# EAGLE design M307mod (EAGLE 4.11)
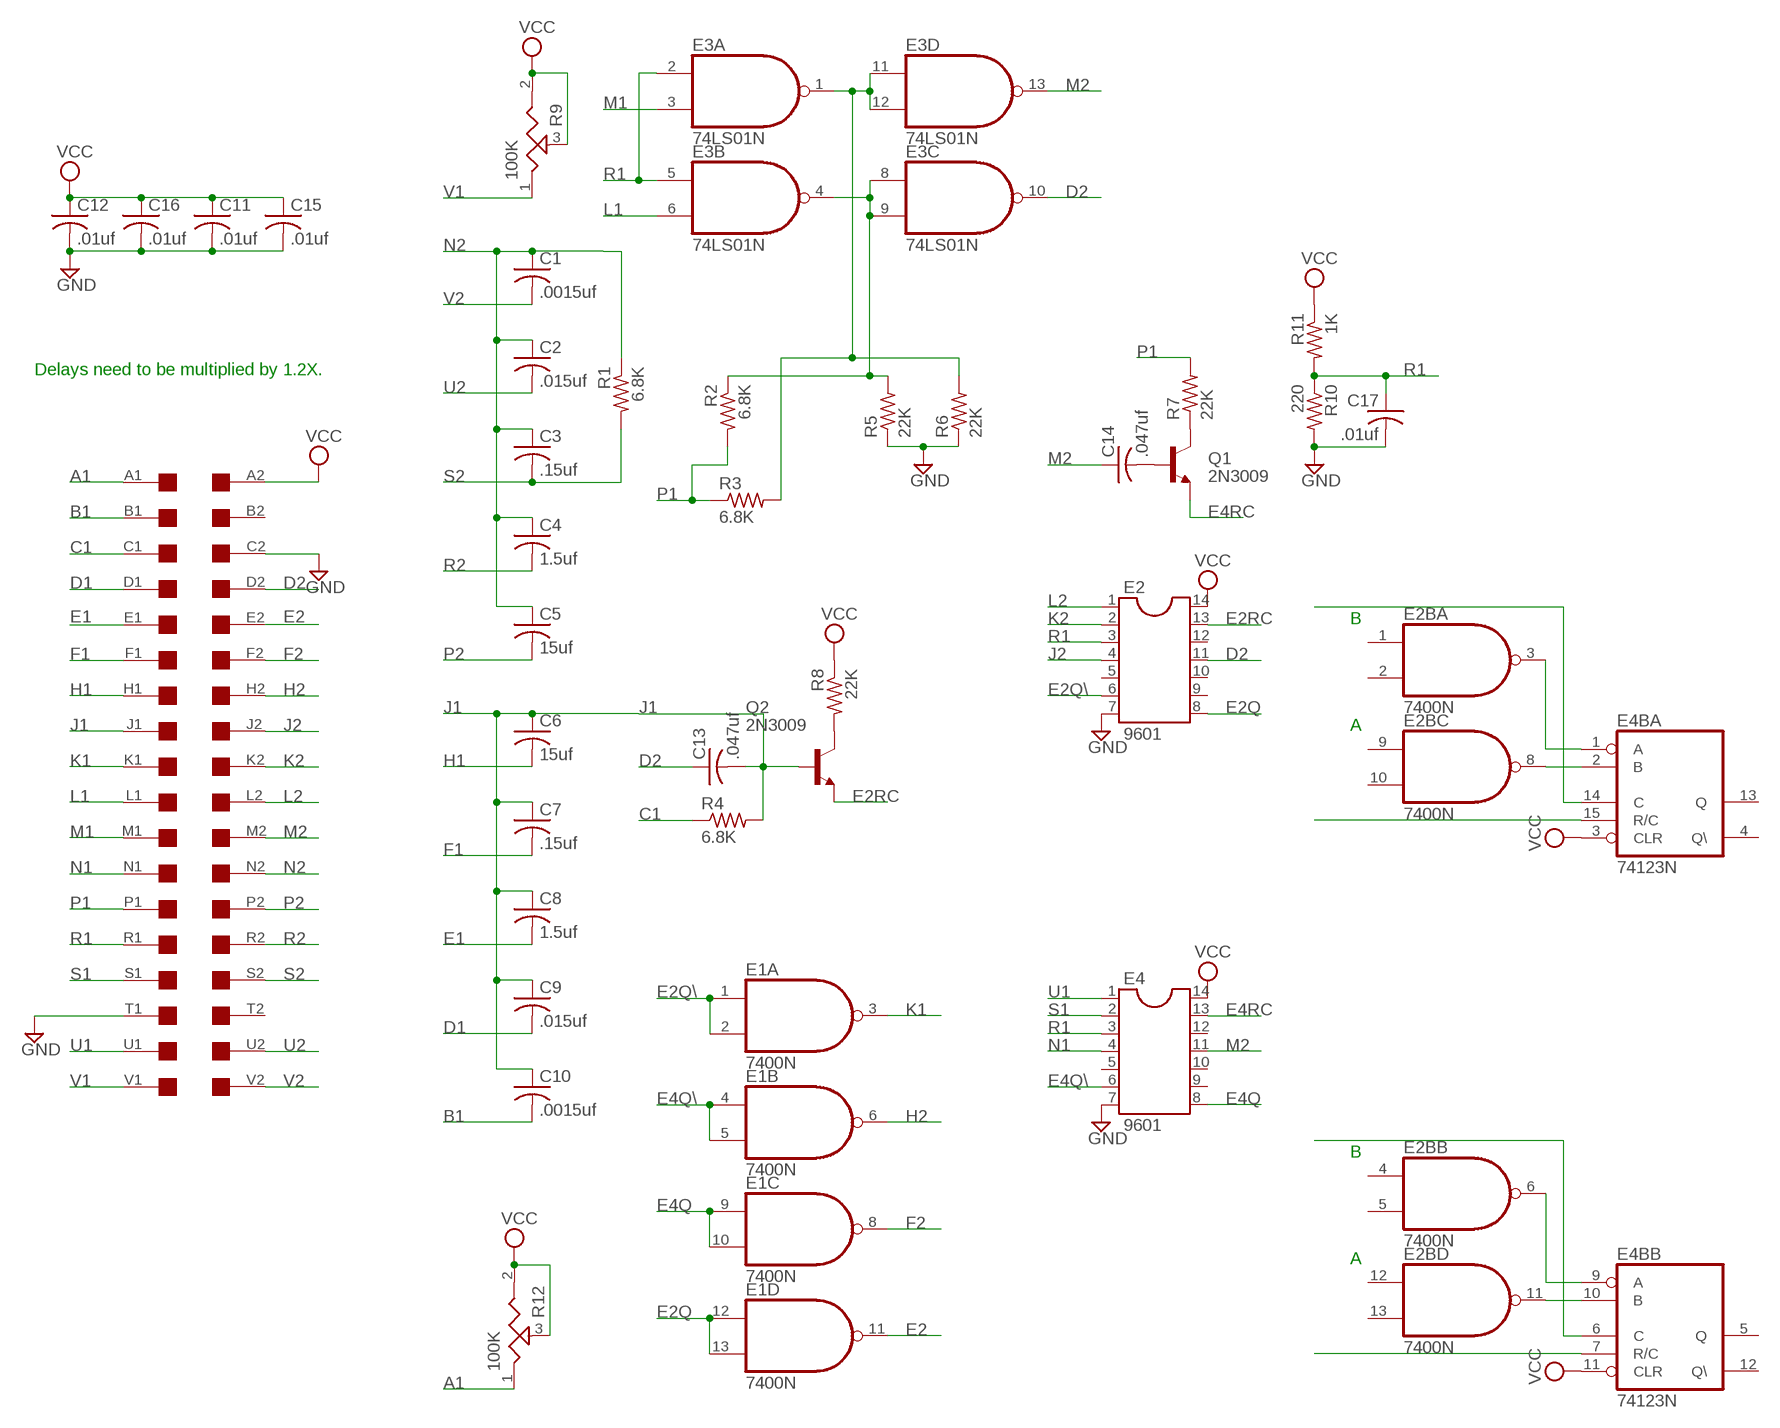
[diagram p0: schematic, sheet 1]

## Parts
A  DEC-FLIPCHIP  [DEC-FLIPCHIP]
C1  .0015uf  C-US150-054X183  [C150-054X183]
C2  .015uf  C-US050-025X075  [C050-025X075]
C3  .15uf  C-US102-043X133  [C102-043X133]
C4  1.5uf  C-US150-054X183  [C150-054X183]
C5  15uf  C-US150-054X183  [C150-054X183]
C6  15uf  C-US150-054X183  [C150-054X183]
C7  .15uf  C-US102-043X133  [C102-043X133]
C8  1.5uf  C-US150-054X183  [C150-054X183]
C9  .015uf  C-US050-025X075  [C050-025X075]
C10  .0015uf  C-US150-054X183  [C150-054X183]
C11  .01uf  C-US050-025X075  [C050-025X075]
C12  .01uf  C-US050-025X075  [C050-025X075]
C13  .047uf  C-US075-032X103  [C075-032X103]
C14  .047uf  C-US075-032X103  [C075-032X103]
C15  .01uf  C-US050-025X075  [C050-025X075]
C16  .01uf  C-US050-025X075  [C050-025X075]
C17  .01uf  C-US050-025X075  [C050-025X075]
E1  7400N  [DIL14]
E2  9601  DIL14  [DIL14]
E2B  7400N  [DIL14]
E3  74LS01N  [DIL14]
E4  9601  DIL14  [DIL14]
E4B  74123N  [DIL16]
Q1  2N3009  2N3019-NPN-TO39-EBC  [TO39]
Q2  2N3009  2N3019-NPN-TO39-EBC  [TO39]
R1  6.8K  R-US_0207/10  [0207/10]
R2  6.8K  R-US_0207/10  [0207/10]
R3  6.8K  R-US_0207/10  [0207/10]
R4  6.8K  R-US_0207/10  [0207/10]
R5  22K  R-US_0207/10  [0207/10]
R6  22K  R-US_0207/10  [0207/10]
R7  22K  R-US_0207/10  [0207/10]
R8  22K  R-US_0207/10  [0207/10]
R9  100K  POTUS-TRIM  [PT-SPIN]
R10  220  R-US_0207/10  [0207/10]
R11  1K  R-US_0207/10  [0207/10]
R12  100K  POTUS-TRIM  [PT-SPIN]

## Nets
A1: A.A1 R12.1
B1: A.B1 C10.2
C1: A.C1 R4.1
CX1: E4B.14(A:C)
CX2: E4B.6(B:C)
D1: A.D1 C9.2
D2: A.D2 C13.1 E2.11 E3.10(C:O)
E1: A.E1 C8.2
E2: A.E2 E1.11(D:O)
E2Q: E1.12(D:I0) E1.13(D:I1) E2.8
E2Q\: E1.1(A:I0) E1.2(A:I1) E2.6
E2RC: E2.13 Q2.1(E)
E4Q: E1.9(C:I0) E1.10(C:I1) E4.8
E4Q\: E1.4(B:I0) E1.5(B:I1) E4.6
E4RC: E4.13 Q1.1(E)
F1: A.F1 C7.2
F2: A.F2 E1.8(C:O)
GND [power]: A.C2 A.T1 C11.2 C12.2 C15.2 C16.2 C17.2 E2.7 E4.7 R5.1 R6.1 R10.2
H1: A.H1 C6.2
H2: A.H2 E1.6(B:O)
J1: A.J1 C6.1 C7.1 C8.1 C9.1 C10.1 C13.2 Q2.2(B) R4.2
J2: A.J2 E2.4
K1: A.K1 E1.3(A:O)
K2: A.K2 E2.2
L1: A.L1 E3.6(B:I1)
L2: A.L2 E2.1
M1: A.M1 E3.3(A:I1)
M2: A.M2 C14.1 E3.13(D:O) E4.11
N1: A.N1 E4.4
N2: A.N2 C1.1 C2.1 C3.1 C4.1 C5.1 R1.1
N$1: Q1.3(C) R7.1
N$2: E4B.15(A:R/C)
N$3: Q2.3(C) R8.2
N$4: E3.1(A:O) E3.11(D:I0) E3.12(D:I1) R3.2 R6.2
N$5: E3.4(B:O) E3.8(C:I0) E3.9(C:I1) R2.1 R5.2
N$6: C14.2 Q1.2(B)
N$11: E2B.3(A:O) E4B.1(A:A)
N$12: E2B.8(C:O) E4B.2(A:B)
N$13: E2B.6(B:O) E4B.9(B:A)
N$14: E2B.11(D:O) E4B.10(B:B)
N$15: E4B.7(B:R/C)
P1: A.P1 R2.2 R3.1 R7.2
P2: A.P2 C5.2
R1: A.R1 C17.1 E2.3 E3.2(A:I0) E3.5(B:I0) E4.3 R10.1 R11.2
R2: A.R2 C4.2
S1: A.S1 E4.2
S2: A.S2 C3.2 R1.2
U1: A.U1 E4.1
U2: A.U2 C2.2
V1: A.V1 R9.1
V2: A.V2 C1.2
VCC [power]: A.A2 C11.1 C12.1 C15.1 C16.1 E2.14 E4.14 E4B.3(A:CLR) E4B.11(B:CLR) R8.1 R9.2 R9.3 R11.1 R12.2 R12.3
Unconnected: A.B2 A.T2 E2.5 E2.9 E2.10 E2.12 E2B.1(A:I0) E2B.2(A:I1) E2B.4(B:I0) E2B.5(B:I1) E2B.9(C:I0) E2B.10(C:I1) E2B.12(D:I0) E2B.13(D:I1) E4.5 E4.9 E4.10 E4.12 E4B.4(A:Q\) E4B.5(B:Q) E4B.12(B:Q\) E4B.13(A:Q)

## Notes on the sheet
- Delays need to be multiplied by 1.2X.
- B
- A
- B
- A

## Power pins joined to a net without a drawn wire
GND: E1.7(P:GND) E2B.7(P:GND) E3.7(P:GND) E4B.8(P:GND)
VCC: E1.14(P:VCC) E2B.14(P:VCC) E3.14(P:VCC) E4B.16(P:VCC)

## Library data of the parts
A = con-dec:DEC-FLIPCHIP: Two-sided DEC Flip-Chip single card fingers
C1-C17 = rcl:C-US: CAPACITOR, American symbol
E1 E2B = 74xx-us:74*00: Quad 2-input NAND gate
E2 E4 = ic-package:DIL14: Dual In Line
E3 = 74xx-us:74*01: Quad 2-input NAND gate, open collector
E4B = 74xx-us:74*123: Retriggerable monostable MULTIVIBRATOR
Q1 Q2 = transistor:*-NPN-: NPN Transistror
R1-R8 R10 R11 = rcl:R-US_: RESISTOR, American symbol
R9 R12 = discrete:POTUS-TRIM

## Net classes
1 power: width 0.508 mm, drill 0.508 mm

## Board
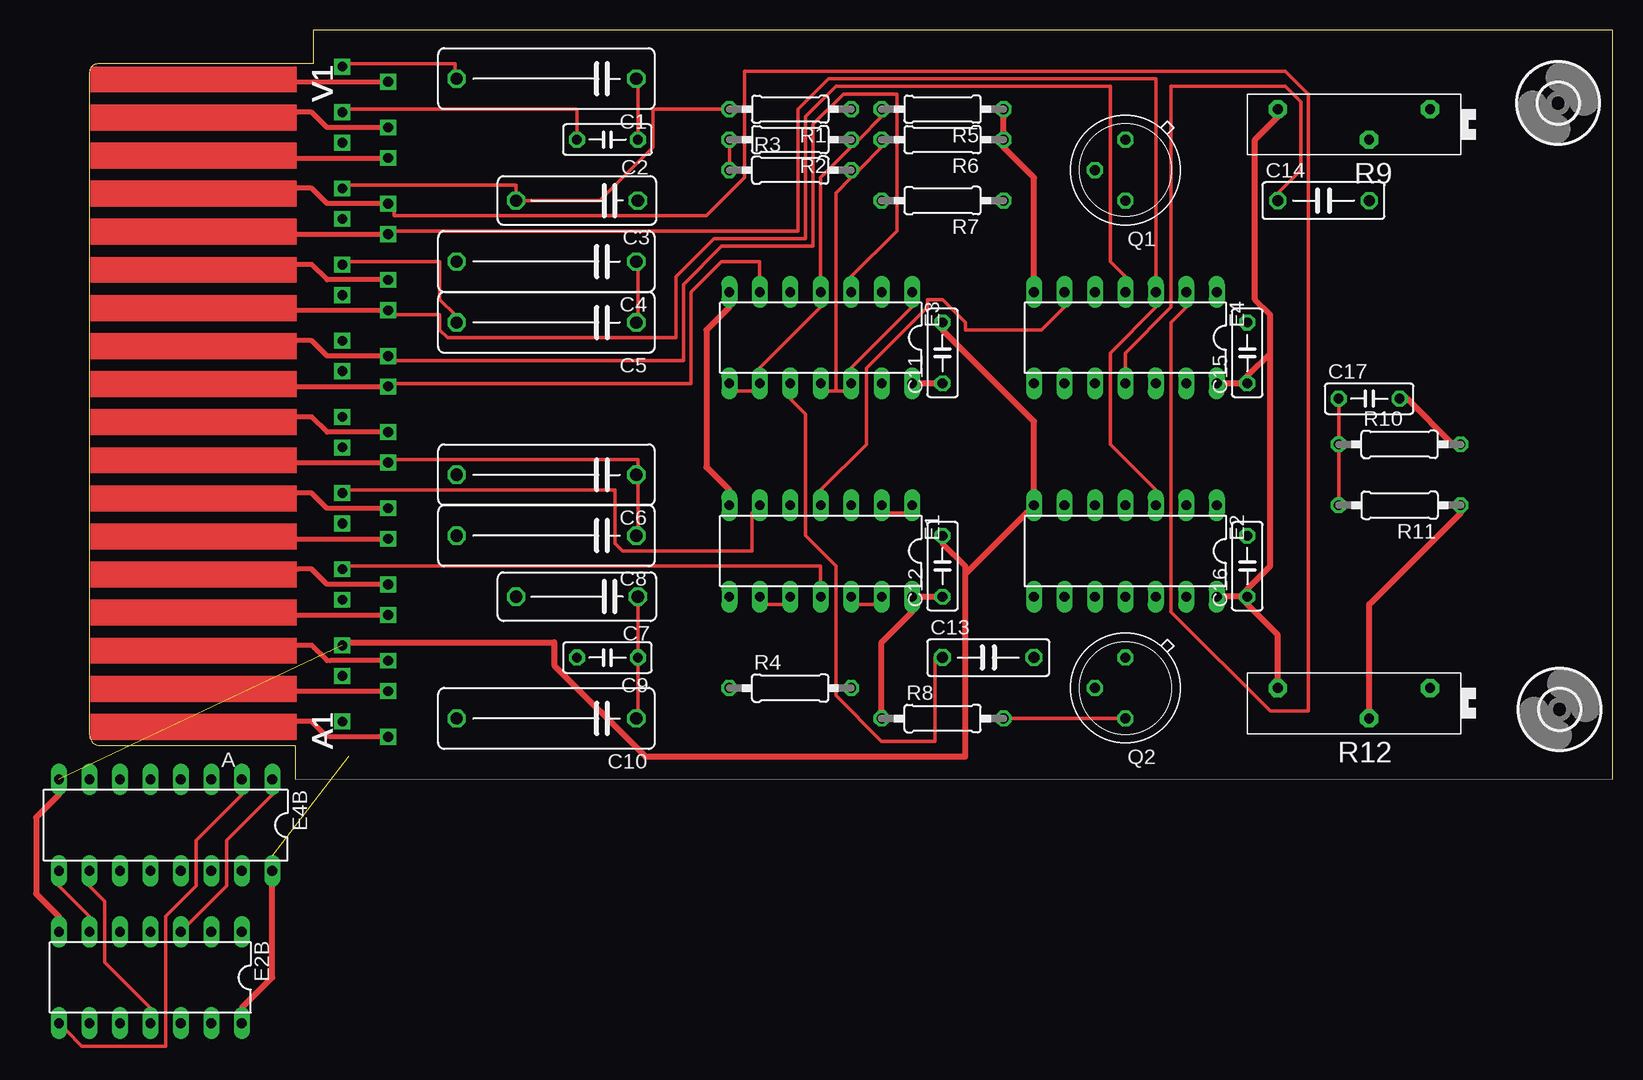
[diagram p1: board, top side]
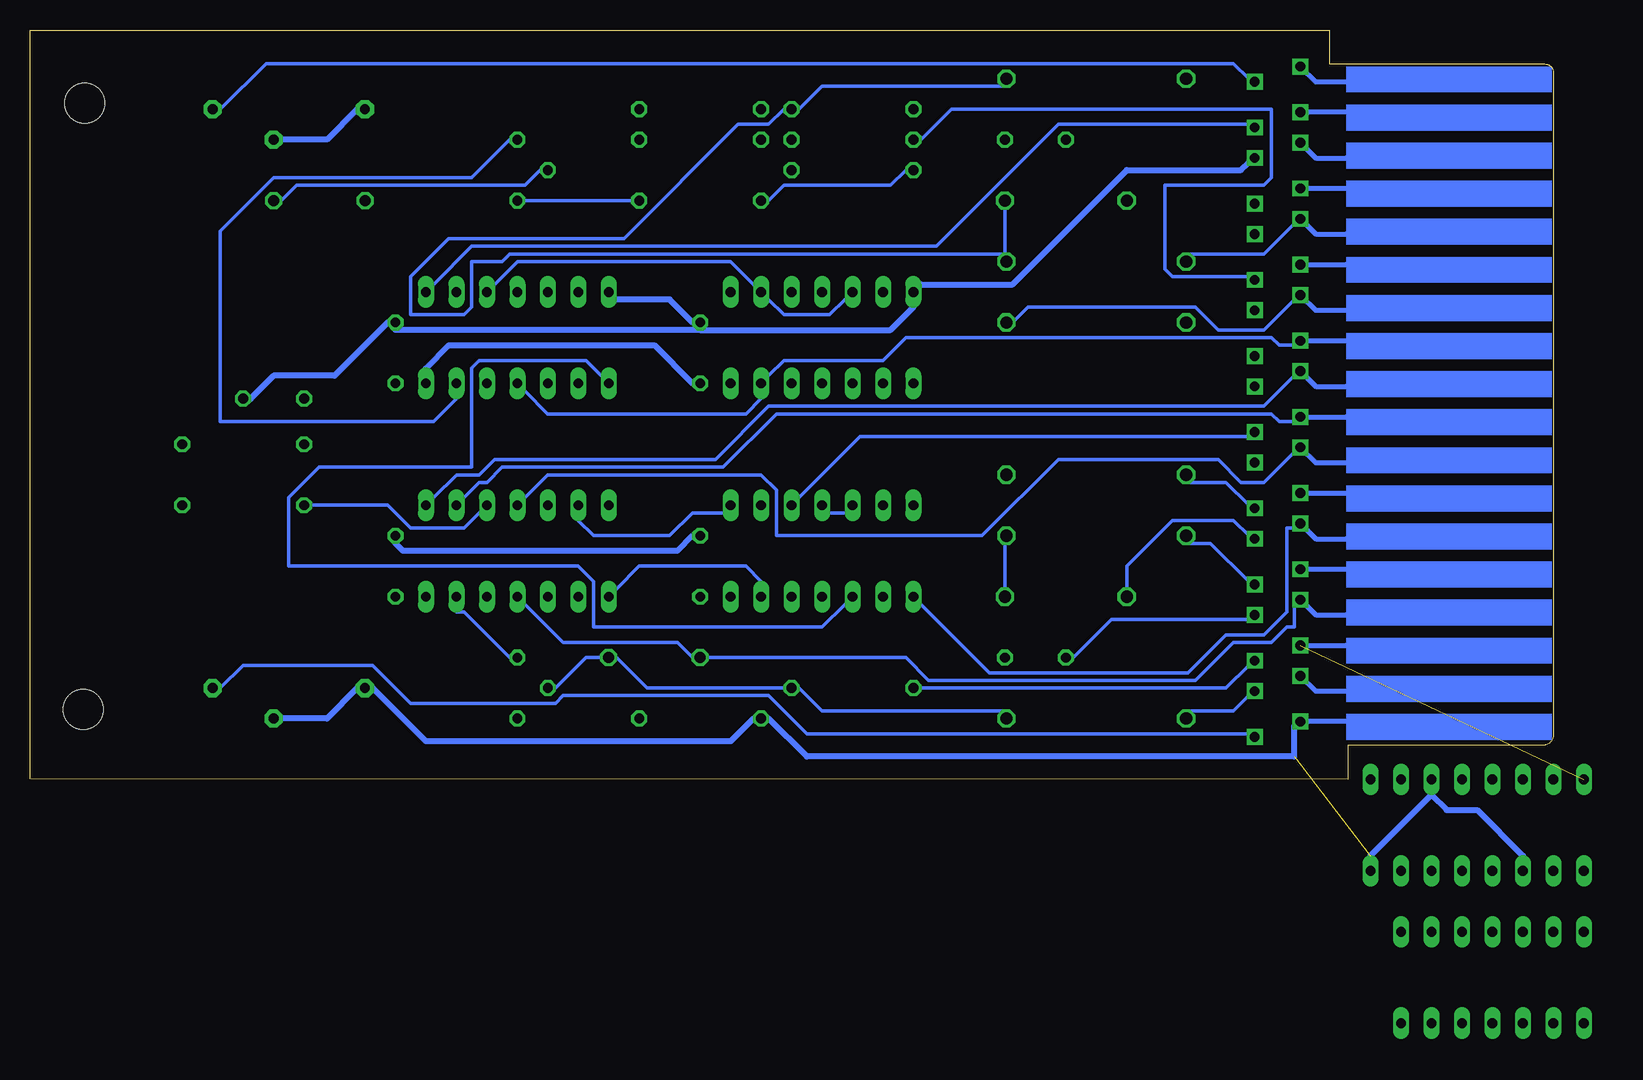
[diagram p2: board, bottom side, seen from below]

Size 126.98 x 62.48 mm. Coordinates in mm from the lower left corner, seen from the top.
Outline: 17.14,2.83 17.14,0 126.98,0.04 126.98,62.45 18.66,62.48 18.66,59.65 0.69,59.65 arc90 0,58.96 0,3.72 arc90 0.89,2.83 17.14,2.83
Copper layers (1*16): Top 0.035mm / dielectric 1.5mm / Bottom 0.035mm
Design rules "10mils": minimum track width 12mil, minimum drill 28mil, track to track 10mil, track to pad 10mil, pad to pad 10mil, via to via 10mil, smd to smd 10mil, copper to edge 40mil, drill to drill 10mil, minimum pad ring 10mil, minimum via ring 8mil, stop-mask expansion 0mil, vias tented up to drill 0mil, thermal gap 10mil

### Footprints (pad centres in the part's own frame; a part is rotated, then mirrored left to right if it is on the bottom)
DEC-FLIPCHIP = drill 0.813 square: A1 -7.62,27.94; A2 -3.81,26.67; B1 -7.62,24.13; B2 -3.81,22.86; C1 -7.62,21.59; C2 -3.81,20.32; D1 -7.62,17.78; D2 -3.81,16.51; E1 -7.62,15.24; E2 -3.81,13.97; F1 -7.62,11.43; F2 -3.81,10.16; H1 -7.62,8.89; H2 -3.81,7.62; J1 -7.62,5.08; J2 -3.81,3.81; K1 -7.62,2.54; K2 -3.81,1.27; L1 -7.62,-1.27; L2 -3.81,-2.54; M1 -7.62,-3.81; M2 -3.81,-5.08; N1 -7.62,-7.62; N2 -3.81,-8.89; P1 -7.62,-10.16; P2 -3.81,-11.43; R1 -7.62,-13.97; R2 -3.81,-15.24; S1 -7.62,-16.51; S2 -3.81,-17.78; T1 -7.62,-20.32; T2 -3.81,-21.59; U1 -7.62,-22.86; U2 -3.81,-24.13; V1 -7.62,-26.67; V2 -3.81,-27.94
C150-054X183 = drill 1.016 octagon: 1 -7.493,0; 2 7.493,0
C050-025X075 = drill 0.813 octagon: 1 -2.54,0; 2 2.54,0
C102-043X133 = drill 1.016 octagon: 1 -5.08,0; 2 5.08,0
C075-032X103 = drill 0.914 octagon: 1 -3.81,0; 2 3.81,0
DIL14 = drill 0.813 long: 1 -7.62,-3.81; 2 -5.08,-3.81; 3 -2.54,-3.81; 4 0,-3.81; 5 2.54,-3.81; 6 5.08,-3.81; 7 7.62,-3.81; 8 7.62,3.81; 9 5.08,3.81; 10 2.54,3.81; 11 0,3.81; 12 -2.54,3.81; 13 -5.08,3.81; 14 -7.62,3.81
DIL16 = drill 0.813 long: 1 -8.89,-3.81; 2 -6.35,-3.81; 3 -3.81,-3.81; 4 -1.27,-3.81; 5 1.27,-3.81; 6 3.81,-3.81; 7 6.35,-3.81; 8 8.89,-3.81; 9 8.89,3.81; 10 6.35,3.81; 11 3.81,3.81; 12 1.27,3.81; 13 -1.27,3.81; 14 -3.81,3.81; 15 -6.35,3.81; 16 -8.89,3.81
TO39 = drill 0.813 octagon: 1 0,-2.54; 2 2.54,0; 3 0,2.54
0207/10 = drill 0.813 octagon: 1 -5.08,0; 2 5.08,0
PT-SPIN = drill 0.813 pad 1.524 octagon: 1 -6.35,-1.27; 2 6.35,-1.27; 3 -1.27,1.27
3,3 = hole 3.3: 0,0

### Placement (x,y rotation side)
A  17.27,31.5 180 top
C1  38.09,58.42 180 top
C2  43.17,53.34 180 top
C3  40.63,48.26 180 top
C4  38.09,43.18 180 top
C5  38.09,38.1 180 top
C6  38.09,25.4 180 top
C7  40.63,15.24 180 top
C8  38.09,20.32 180 top
C9  43.17,10.16 180 top
C10  38.09,5.08 180 top
C11  71.12,35.56 90 top
C12  71.12,17.78 90 top
C13  74.93,10.16 0 top
C14  102.87,48.26 0 top
C15  96.52,35.56 90 top
C16  96.52,17.78 90 top
C17  106.68,31.75 0 top
E1  60.95,19.05 180 top
E2  86.36,19.05 180 top
E2B  5.08,-16.51 180 top  (outside the outline)
E3  60.95,36.83 180 top
E4  86.36,36.83 180 top
E4B  6.34,-3.81 180 top
Q1  86.36,50.8 180 top
Q2  86.36,7.62 180 top
R1  58.41,55.88 180 top
R2  58.41,53.34 180 top
R3  58.41,50.8 0 top
R4  58.41,7.62 0 top
R5  71.12,55.88 180 top
R6  71.12,53.34 180 top
R7  71.12,48.26 180 top
R8  71.12,5.08 0 top
R9  105.41,54.61 180 top
R10  109.22,27.94 0 top
R11  109.22,22.86 180 top
R12  105.41,6.35 180 top
U$2  [3,3]  122.42,56.39 0 top
U$3  [3,3]  122.55,5.84 0 top

### Tracks (layer width: path | path; a pad name or v marks a point on that pad's centre or on a via)
A1
  Bottom 0.305: A.A1 25.39,3.81 62.22,3.81 65.4,6.99 82.55,6.99 83.18,6.35 95.25,6.35 98.42,9.53 109.22,9.53 111.12,7.62 R12.1
B1
  Bottom 0.305: A.B1 25.39,6.99 26.67,5.71 30.48,5.71 C10.2
C1
  Bottom 0.305: A.C1 25.39,9.53 27.3,7.62 52.7,7.62 R4.1
D1
  Bottom 0.305: C9.2 40,10.16 36.82,13.34 25.39,13.34 A.D1
D2
  Top 0.305: E3.10 58.41,31.75 59.68,30.48 59.68,20.32 62.22,17.78 62.22,6.99 66.04,3.17 70.48,3.17 70.48,10.16 C13.1
  Bottom 0.305: A.D2 21.59,14.61 21.59,12.7 22.22,12.7 23.49,11.43 26.67,11.43 29.84,8.26 52.06,8.26 53.97,10.16 70.48,10.16 C13.1 71.75,10.16 73.02,11.43 82.55,11.43 85.72,14.61 E2.11
E1
  Bottom 0.305: A.E1 25.39,16.51 28.57,19.68 30.48,19.68 C8.2
E2
  Top 0.305: A.E2 21.59,17.78 60.95,17.78 60.95,16.51 E1.11
E2Q
  Top 0.305: E1.12 64.13,14.61 65.4,14.61 E1.13
  Bottom 0.305: E2.8 78.1,15.88 76.2,17.78 67.31,17.78 66.04,16.51 E1.13
E2Q\
  Top 0.305: E1.2 66.67,22.23 67.94,22.23 E1.1
  Bottom 0.305: E2.6 81.28,21.59 80.01,20.32 73.66,20.32 71.75,22.23 69.21,22.23 E1.1
E2RC
  Bottom 0.305: Q2.1 86.99,10.16 90.8,13.97 91.44,13.97 E2.13
E4Q
  Top 0.305: E1.9 56.51,14.61 57.78,14.61 E1.10
  Bottom 0.305: E4.8 79.37,33.66 80.64,34.92 89.53,34.92 90.17,34.29 90.17,26.04 102.87,26.04 105.41,23.5 105.41,17.78 81.28,17.78 80.01,16.51 80.01,12.7 60.95,12.7 59.05,14.61 E1.10
E4Q\
  Top 0.305: E4.6 81.28,39.37 79.37,37.47 73.02,37.47 73.02,38.1 71.12,40.01 69.84,40.01 69.84,39.37 64.77,34.29 64.77,27.94 60.95,24.13 E1.4
  Bottom 0.305: E1.5 59.05,22.23 60.32,22.23 E1.4
E4RC
  Bottom 0.305: Q1.1 86.99,53.34 90.17,50.16 106.68,50.16 111.12,45.72 111.12,29.84 93.34,29.84 91.44,31.75 E4.13
F1
  Bottom 0.305: A.F1 25.39,20.32 26.67,21.59 31.75,21.59 35.55,17.78 35.55,15.88 C7.2
F2
  Bottom 0.305: E1.8 52.7,14.61 46.98,8.89 30.48,8.89 27.3,12.06 24.12,12.06 22.22,13.97 22.22,20.95 21.59,20.95 A.F2
GND  (1 unrouted)
  Top 0.508: E1.7 53.34,24.13 51.43,26.04 51.43,37.47 53.34,39.37 E3.7 | R10.2 113.66,27.94 109.85,31.75 C17.2 | R5.1 76.2,55.24 76.2,53.98 R6.1 76.2,52.7 78.73,50.16 78.73,41.91 E4.7 | 73.02,17.14 73.02,17.78 71.12,19.68 C12.2 | 73.02,17.14 73.02,1.91 46.35,1.91 38.73,9.53 38.73,11.43 21.59,11.43 A.C2 | 73.02,17.14 78.1,22.23 E2.7 78.73,24.13 78.73,29.84 71.12,37.47 C11.2 | E2B.7 -2.54,-11.43 -4.45,-9.53 -4.45,-3.17 -2.54,-1.27 E4B.8
  Bottom 0.508: A.T1 25.39,51.44 26.03,50.8 35.55,50.8 45.08,41.27 52.7,41.27 E3.7 53.34,39.37 55.24,37.47 71.12,37.47 | C17.2 108.58,31.75 106.68,33.66 101.59,33.66 97.15,38.1 C15.2 96.52,37.47 71.12,37.47 | C11.2 71.75,38.1 73.66,40.01 78.1,40.01 E4.7 | C16.2 96.52,19.68 95.88,19.05 73.02,19.05 71.75,20.32 C12.2 | C11.2 71.12,37.47 | C11.2 71.12,37.47
H1
  Bottom 0.305: A.H1 25.39,22.86 27.3,24.77 30.48,24.77 C6.2
H2
  Top 0.305: A.H2 21.59,24.13 43.81,24.13 43.81,19.68 44.45,19.05 55.24,19.05 55.24,22.23 E1.6
J1
  Top 0.305: A.J1 25.39,26.67 45.71,26.67 45.71,26.04 C6.1 45.71,24.77 45.71,20.95 C8.1 | C10.1 45.71,5.71 45.71,9.53 C9.1 45.71,10.79 45.71,14.61 C7.1
  Bottom 0.305: Q2.2 83.18,7.62 80.64,10.16 79.37,10.16 C13.2 78.1,10.16 75.56,7.62 64.13,7.62 R4.2 62.86,7.62 60.95,5.71 45.71,5.71 C10.1 | C8.1 45.71,19.68 45.71,15.88 C7.1
J2
  Bottom 0.305: E2.4 85.72,23.5 83.81,25.4 66.04,25.4 64.77,24.13 64.77,20.32 47.62,20.32 41.27,26.67 27.94,26.67 26.03,24.77 24.12,24.77 21.59,27.3 A.J2
K1
  Bottom 0.305: E1.3 62.86,23.5 57.78,28.57 25.39,28.57 A.K1
K2
  Bottom 0.305: A.K2 21.59,29.84 22.86,29.84 23.49,30.48 64.77,30.48 69.21,26.04 87.62,26.04 88.9,24.77 89.53,24.77 90.8,23.5 E2.2
L1
  Top 0.305: A.L1 25.39,33.02 50.16,33.02 50.16,40.64 52.7,43.18 55.88,43.18 55.88,41.91 E3.6
L2
  Bottom 0.305: A.L2 21.59,33.66 24.12,31.11 65.4,31.11 69.84,26.67 88.26,26.67 89.53,25.4 91.44,25.4 93.34,23.5 E2.1
M1
  Top 0.305: A.M1 25.39,34.92 49.52,34.92 49.52,41.27 52.7,44.45 60.32,44.45 60.32,54.61 62.86,57.15 67.31,57.15 67.31,45.72 63.49,41.91 E3.3
M2
  Top 0.305: C14.1 99.06,48.9 100.96,50.8 100.96,56.52 99.69,57.78 90.17,57.78 90.17,39.37 86.36,35.56 86.36,34.29 E4.11
  Bottom 0.305: E4.11 85.72,32.38 83.81,30.48 67.31,30.48 66.04,31.75 E3.13 65.4,33.66 64.13,34.92 55.88,34.92 53.97,36.83 23.49,36.83 22.86,36.2 21.59,36.2 A.M2
N1
  Top 0.305: A.N1 25.39,38.73 29.21,38.73 29.21,37.47 29.84,36.83 48.89,36.83 48.89,41.91 52.06,45.09 59.68,45.09 59.68,55.24 62.22,57.78 85.09,57.78 85.09,43.18 86.36,41.91 E4.4
N2
  Top 0.305: C2.1 45.71,53.98 45.71,57.78 C1.1 | C4.1 45.71,42.55 45.71,38.73 C5.1
  Bottom 0.305: C1.1 45.71,57.78 60.95,57.78 62.86,55.88 R1.1 64.13,55.88 65.4,54.61 67.94,54.61 77.47,45.09 92.07,45.09 95.25,41.91 95.25,38.73 90.8,38.73 90.17,39.37 90.17,43.18 87.62,43.18 86.99,43.81 45.71,43.81 | A.N2 21.59,40.01 24.12,37.47 27.94,37.47 29.84,39.37 43.81,39.37 45.08,38.1 C5.1 | 45.71,43.81 45.71,47.62 C3.1 | 45.71,43.81 C4.1 45.71,43.81
N$1
  Bottom 0.305: R7.1 76.83,48.26 85.72,48.26 Q1.3
N$3
  Top 0.305: R8.2 76.83,5.08 85.72,5.08 Q2.3
N$4
  Top 0.305: R6.2 66.04,52.7 64.13,50.8 R3.2 63.49,50.16 62.22,48.9 62.22,32.38 | 62.22,32.38 62.86,32.38 E3.12 63.49,34.29 68.58,39.37 E3.1 | 62.22,32.38 61.59,32.38 E3.11
N$5
  Top 0.305: R5.2 66.04,55.24 64.13,53.34 R2.1 63.49,52.7 60.95,50.16 60.95,41.91 E3.4 60.95,39.37 55.88,34.29 E3.9 55.24,32.38 53.97,32.38 E3.8
N$6
  Bottom 0.305: Q1.2 84.45,50.8 85.72,49.53 104.77,49.53 106.04,48.26 C14.2
N$11
  Top 0.305: E2B.3 8.25,-12.06 11.42,-8.89 11.42,-5.08 15.23,-1.27 E4B.1
N$12
  Top 0.305: E2B.8 -1.91,-20.95 -0.64,-22.23 6.34,-22.23 6.34,-11.43 8.88,-8.89 8.88,-5.08 12.69,-1.27 E4B.2
N$13
  Top 0.305: E4B.9 -2.54,-8.89 -0.01,-11.43 E2B.6
N$14
  Top 0.305: E4B.10 -0.01,-8.89 1.27,-10.16 1.27,-15.24 5.08,-19.05 E2B.11
P1
  Top 0.305: R3.1 53.34,51.44 53.34,52.7 R2.2
  Bottom 0.305: A.P1 25.39,41.91 31.75,41.91 32.38,42.55 32.38,49.53 24.12,49.53 23.49,50.16 23.49,55.88 50.16,55.88 52.7,53.34 R2.2 | R7.2 65.4,48.26 64.13,49.53 55.24,49.53 53.97,50.8 R3.1
P2
  Top 0.305: A.P2 21.59,43.18 29.21,43.18 29.21,40.01 30.48,38.73 C5.2
R1
  Top 0.305: C17.1 104.14,31.11 104.14,28.57 R10.1 104.14,27.3 104.14,23.5 R11.2 | A.R1 25.39,45.72 59.05,45.72 59.05,55.88 61.59,58.42 88.9,58.42 88.9,41.91 E4.3 88.9,39.37 85.09,35.56 85.09,27.94 88.9,24.13 E2.3
  Bottom 0.305: E2.3 89.53,22.23 90.8,20.95 95.25,20.95 97.15,22.86 103.5,22.86 R11.2 | E3.5 59.05,40.01 60.32,38.73 64.13,38.73 65.4,40.01 E3.2 66.67,41.27 68.58,43.18 86.36,43.18 88.26,41.27 E4.3
R2
  Bottom 0.305: A.R2 21.59,46.35 24.12,43.81 30.48,43.81 C4.2
S1
  Top 0.305: E4.2 91.44,39.37 90.17,38.1 90.17,13.97 98.42,5.71 101.59,5.71 101.59,57.15 99.69,59.05 54.6,59.05 54.6,50.16 51.43,46.99 25.39,46.99 25.39,47.62 A.S1
S2
  Top 0.305: A.S2 21.59,49.53 35.55,49.53 35.55,48.9 C3.2 36.19,48.26 42.54,48.26 46.98,52.7 46.98,55.88 52.7,55.88 R1.2
U1
  Bottom 0.305: E4.1 93.34,41.27 90.17,44.45 51.43,44.45 41.27,54.61 25.39,54.61 A.U1
U2
  Top 0.305: A.U2 21.59,55.88 40.63,55.88 40.63,53.98 C2.2
V1
  Bottom 0.305: A.V1 25.39,58.42 26.67,59.69 107.31,59.69 111.12,55.88 R9.1
V2
  Top 0.305: A.V2 21.59,59.69 30.48,59.69 30.48,59.05 C1.2
VCC  (1 unrouted)
  Top 0.508: E2B.14 12.69,-19.05 15.23,-16.51 15.23,-8.89 E4B.16 | C12.1 70.48,15.24 69.21,15.24 E1.14 68.58,13.97 66.04,11.43 66.04,5.71 R8.1 | E2.14 94.61,15.24 95.88,15.24 C16.1 | R11.1 114.3,22.23 106.68,14.61 106.68,5.71 R12.3 | C16.1 96.52,14.61 99.06,12.06 99.06,8.26 R12.2 | E3.14 69.21,33.02 70.48,33.02 C11.1 | E4.14 94.61,33.02 95.88,33.02 C15.1 96.52,33.66 98.42,35.56 | 98.42,35.56 98.42,38.73 97.15,40.01 97.15,53.34 99.06,55.24 R9.2 | 98.42,35.56 98.42,17.78 96.52,15.88 C16.1
  Bottom 0.508: 10.15,-1.27 8.88,-2.54 6.34,-2.54 2.54,-6.35 E4B.11 | 10.15,-1.27 E4B.3 10.15,-1.27 | 10.15,-1.27 15.23,-6.35 E4B.16 | A.A2 21.59,4.45 21.59,1.91 62.22,1.91 65.4,5.08 R8.1 66.67,5.08 68.58,3.17 93.98,3.17 98.42,7.62 R12.2 99.69,7.62 102.23,5.08 106.04,5.08 R12.3 | R9.2 99.69,55.88 102.23,53.34 106.04,53.34 R9.3 | C11.1 71.75,33.02 74.93,36.2 92.07,36.2 93.98,34.29 E4.14

### Text on the board
tNames: V1 | V1 | V1 | V1 | V1 | V1 | V1 | V1 | V1 | V1 | V1 | V1 | V1 | V1 | V1 | V1 | V1 | V1 | V1 | V1 | V1 | V1 | V1 | V1 | V1 | V1 | V1 | V1 | V1 | V1 | V1 | V1 | A1 | A1 | A1 | A1 | A1 | A1 | A1 | A1 | A1 | A1 | A1 | A1 | A1 | A1 | A1 | A1 | A1 | A1 | A1 | A1 | A1 | A1 | A1 | A1 | A1 | A1 | A1 | A1 | A1 | A1 | A1 | A1